# Altium project STM32H743.PrjPcb
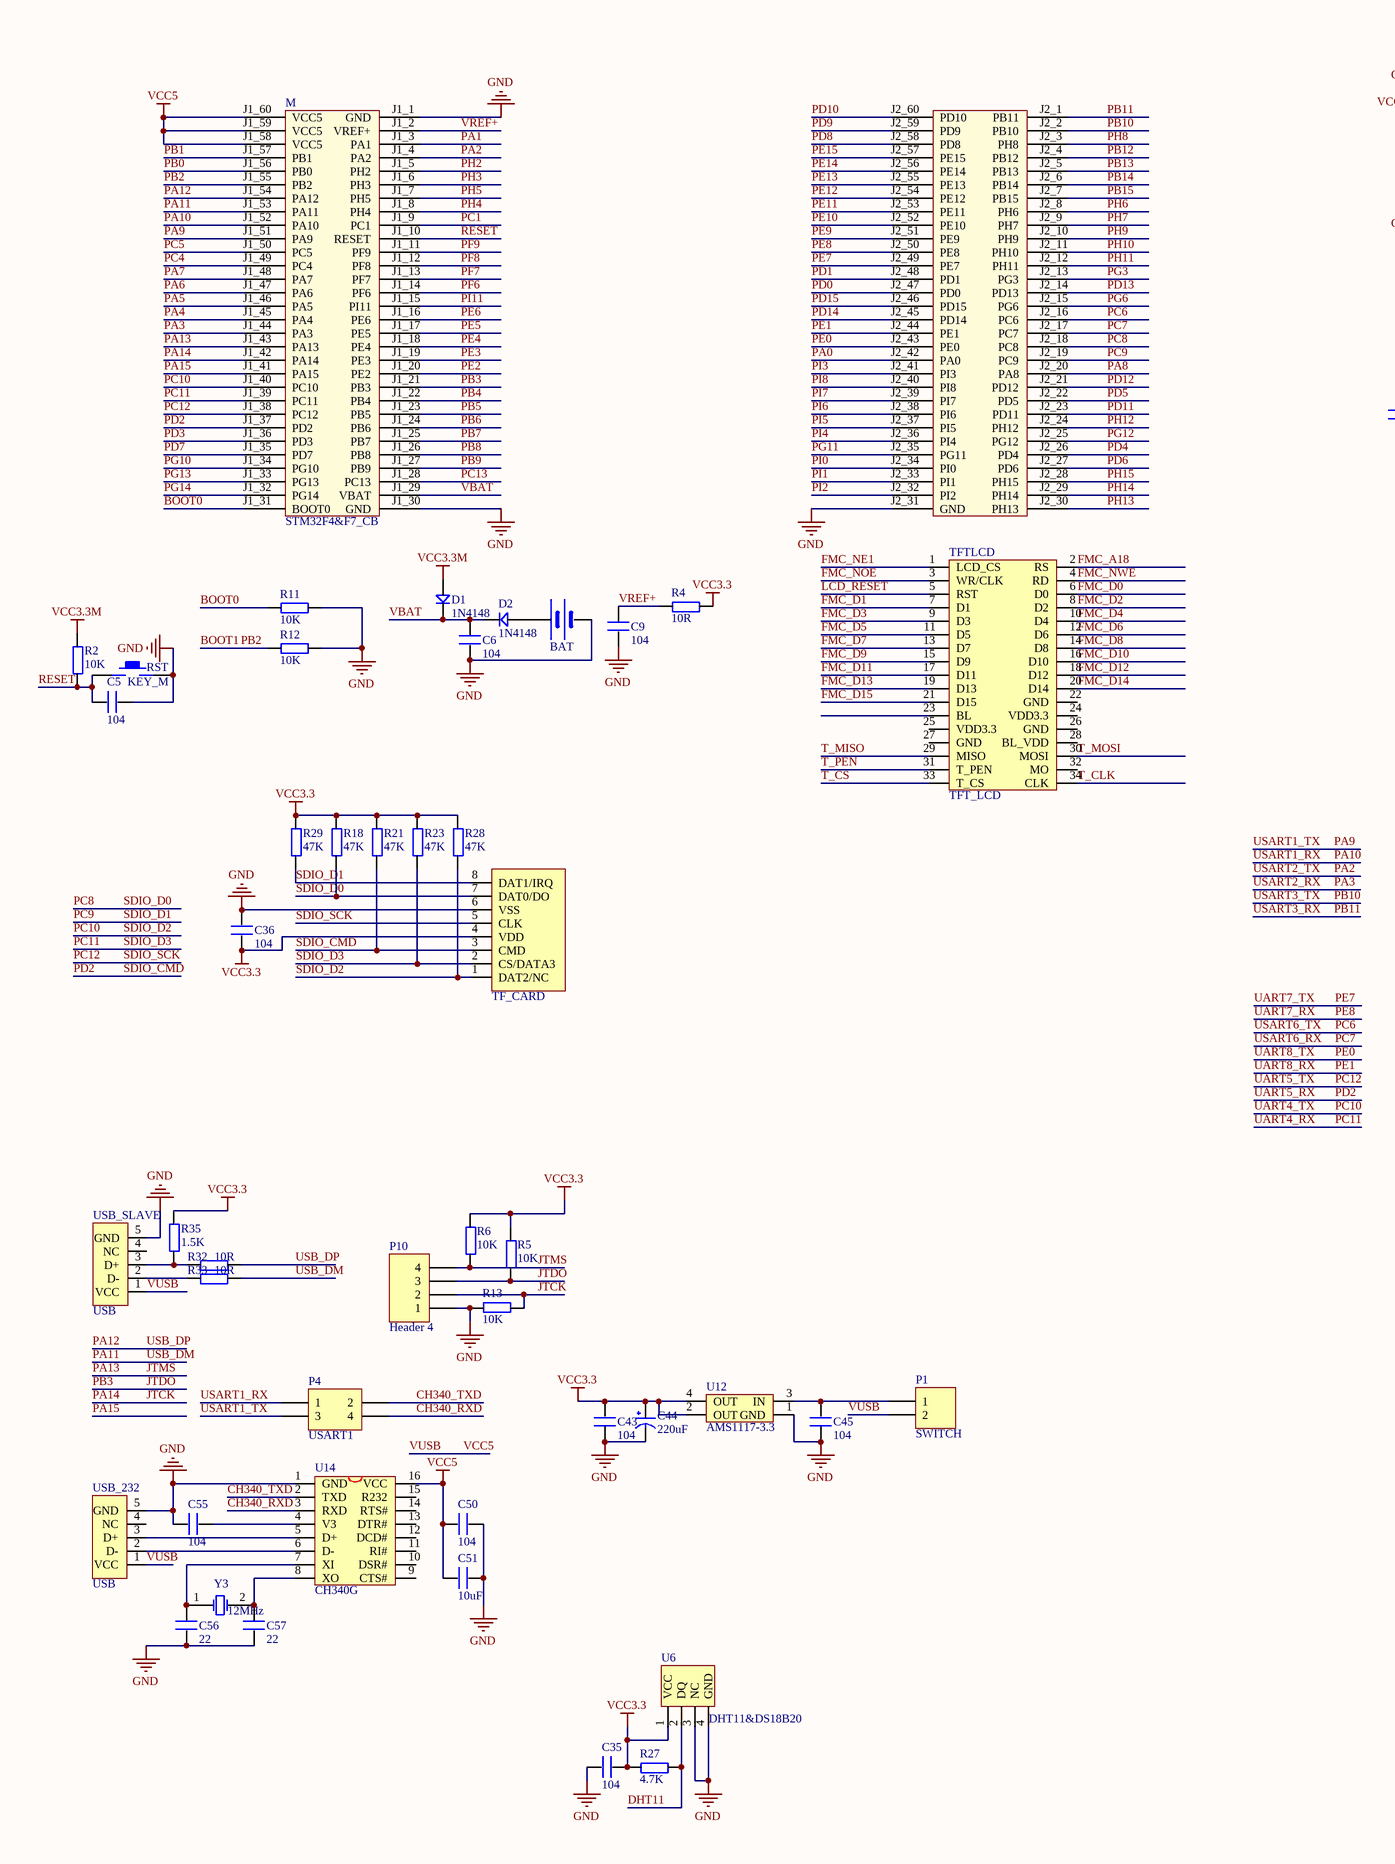
[diagram p0: STM32H743.SchDoc, left]
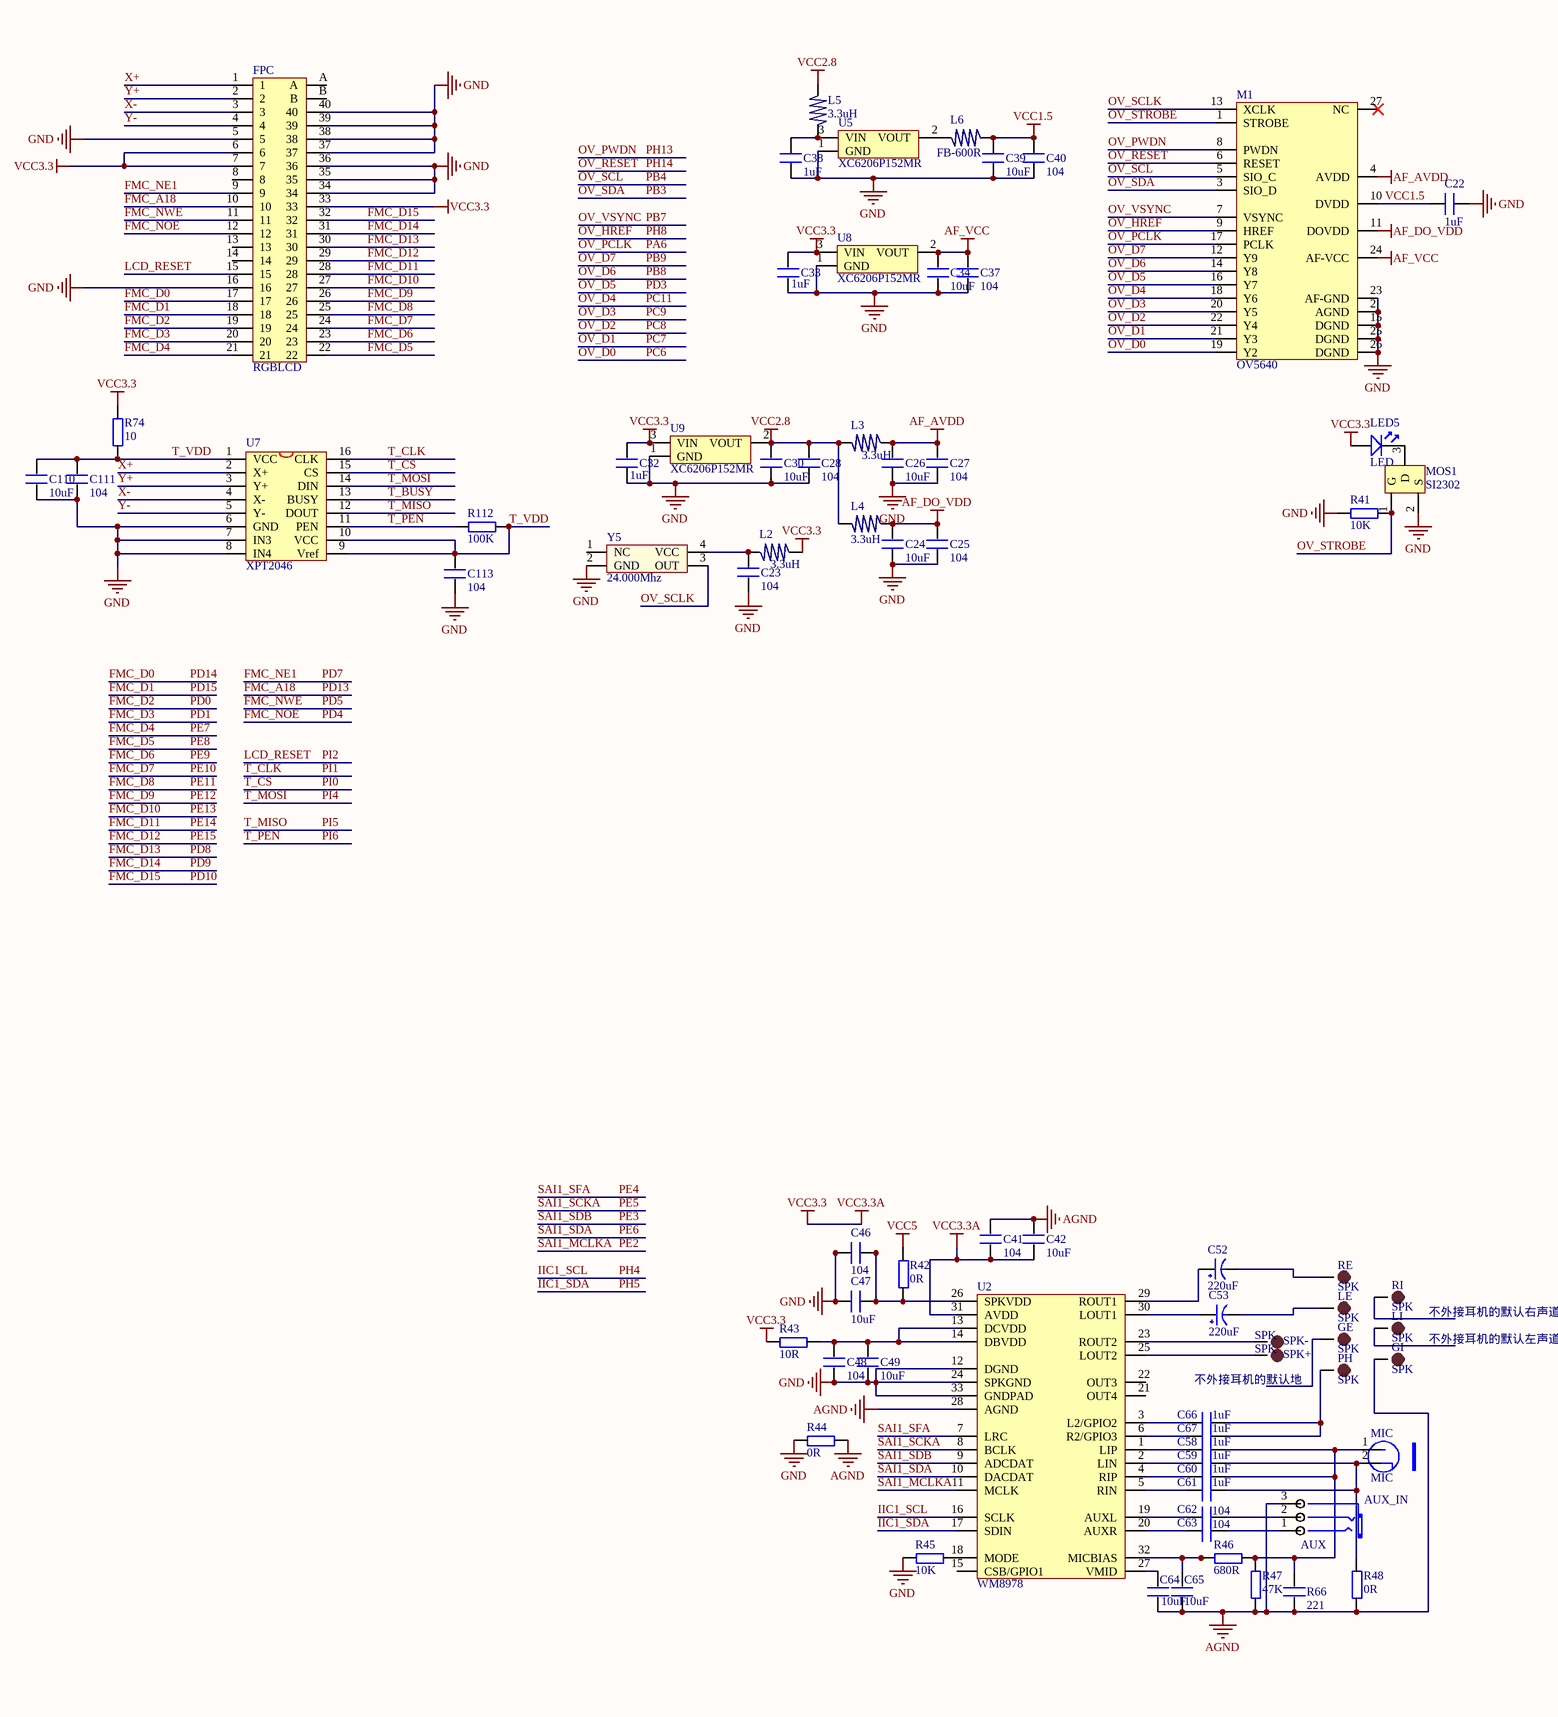
[diagram p1: STM32H743.SchDoc, right]
1 sheet, 118 parts. Net scope: global (net labels, ports and power ports of the same name join across sheets).
Board file: STM32H743.PcbDoc

## Sheet STM32H743.SchDoc
size A2

### Parts
AUX_IN  AUX  [PHONE_ST]
BAT  BATT  [CR1220_A]  (value not drawn)
C5  104  [C 0603_M]
C6  104  [C 0603_M]
C9  104  [C 0603_M]
C22  1uF  [C 0603_M]
C23  104  [C 0603_M]
C24  10uF  [C 0603_M]
C25  104  [C 0603_M]
C26  10uF  [C 0603_M]
C27  104  [C 0603_M]
C28  104  [C 0603_M]
C30  10uF  [C 0603_M]
C32  1uF  [C 0603_M]
C33  1uF  [C 0603_M]
C34  10uF  [C 0603_M]
C35  104  [C 0603_M]
C36  104  [C 0603_M]
C37  104  [C 0603_M]
C38  1uF  [C 0603_M]
C39  10uF  [C 0603_M]
C40  104  [C 0603_M]
C41  104  [C 0603_M]
C42  10uF  [C 0603_M]
C43  104  [C 0603_M]
C44  220uF  [CT 6*6 - C]
C45  104  [C 0603_M]
C46  104  [C 0603_M]
C47  10uF  [C 0603_M]
C48  104  [C 0603_M]
C49  10uF  [C 0603_M]
C50  104  [C 0603_M]
C51  10uF  [C 0603_M]
C52  220uF  [CT 6*6 - C]
C53  220uF  [CT 6*6 - C]
C55  104  [C 0603_M]
C56  22  [C 0603_M]
C57  22  [C 0603_M]
C58  1uF  [C 0603_M]
C59  1uF  [C 0603_M]
C60  1uF  [C 0603_M]
C61  1uF  [C 0603_M]
C62  104  [C 0603_M]
C63  104  [C 0603_M]
C64  10uF  [C 0603_M]
C65  10uF  [C 0603_M]
C66  1uF  [C 0603_M]
C67  1uF  [C 0603_M]
C110  10uF  [C 0603_M]
C111  104  [C 0603_M]
C113  104  [C 0603_M]
D1  1N4148  [DIODE_SOP]
D2  1N4148  [DIODE_SOP]
FPC  RGBLCD  [FPC-TOP40]
GE  SPK  [TP-1.5]
GI  SPK  [TP-1.5]
L2  3.3uH  [L 0603]
L3  3.3uH  [L 0603]
L4  3.3uH  [L 0603]
L5  3.3uH  [L 0603]
L6  FB-600R  [L 0603]
LE  SPK  [TP-1.5]
LED5  LED  [LED 0805R]
LI  SPK  [TP-1.5]
M  STM32F4&F7_CB  [STM32F4&F7_CB]
M1  OV5640  [OV5640-24]
MIC  MIC  [MIC-6022]
MOS1  SI2302  [SOT23-3M]
P1  SWITCH  [HDR2.54-LI-2P]
P4  USART1  [HDR2.54-LI-2x2P]
P10  Header 4  [HDR2.54-LI-4P]
PH  SPK  [TP-1.5]
R2  10K  [R 0603_M]
R4  10R  [R 0603_M]
R5  10K  [R 0603_M]
R6  10K  [R 0603_M]
R11  10K  [R 0603_M]
R12  10K  [R 0603_M]
R13  10K  [R 0603_M]
R18  47K  [R 0603_M]
R21  47K  [R 0603_M]
R23  47K  [R 0603_M]
R27  4.7K  [R 0603_M]
R28  47K  [R 0603_M]
R29  47K  [R 0603_M]
R32  10R  [R 0603_M]
R33  10R  [R 0603_M]
R35  1.5K  [R 0603_M]
R41  10K  [R 0603_M]
R42  0R  [R 0603_M]
R43  10R  [R 0603_M]
R44  0R  [R 0603_M]
R45  10K  [R 0603_M]
R46  680R  [R 0603_M]
R47  47K  [R 0603_M]
R48  0R  [R 0603_M]
R66  221  [C 0603_M]
R74  10  [R 0603_M]
R112  100K  [R 0603_M]
RE  SPK  [TP-1.5]
RI  SPK  [TP-1.5]
RST  KEY_M  [TSW SMD-3*6*2.5]
SPK+  SPK  [TP-1.5]
SPK-  SPK  [TP-1.5]
TF_CARD  SD-MICRO-TF  [SD-MICRO-TF]  (value not drawn)
TFTLCD  TFT_LCD  [DB2*17-3.5]
U2  WM8978  [qfn32]
U5  XC6206P152MR  [SOT23-3M]
U6  DHT11&DS18B20  [DHT11]
U7  XPT2046  [SSOP16_M]
U8  XC6206P152MR  [SOT23-3M]
U9  XC6206P152MR  [SOT23-3M]
U12  AMS1117-3.3  [AMS1117]
U14  CH340G  [SOP16_M]
USB_232  USB  [USB-MINI-A]
USB_SLAVE  USB  [USB-MINI-A]
Y3  12MHz  [OSC HC-49S]
Y5  24.000Mhz  [OSC 3225-4P]

### Nets
AF_AVDD: C26.2 C27.2 L3.1 M1.4(AVDD)
AF_DO_VDD: C24.2 C25.2 L4.1 M1.11(DOVDD)
AF_VCC: C34.2 C37.2 M1.24(AF-VCC) U8.2(VOUT)
AGND: AUX_IN.3(COM) C41.2 C42.2 C64.1 C65.1 GI.1 R44.2 R47.1 R48.1 R66.1 U2.28(AGND)
GND: BAT.2(GND) C5.1 C6.1 C9.1 C22.2 C23.1 C24.1 C25.1 C26.1 C27.1 C28.1 C30.1 C32.1 C33.1 C34.1 C35.1 C36.2 C37.1 C38.1 C39.1 C40.1 C43.1 C44.2(GND) C45.1 C46.1 C47.1 C48.1 C49.1 C50.2 C51.2 C55.1 C56.1 C57.2 C110.1 C111.1 C113.1 FPC.5 FPC.16 FPC.34 FPC.35 FPC.36 FPC.37 FPC.38 FPC.39 FPC.40 M.J1_1(GND) M.J1_30(GND) M.J2_31(GND) M1.2(AGND) M1.15(DGND) M1.23(AF-GND) M1.25(DGND) M1.26(DGND) MOS1.2(S) P10.1 R11.2 R12.2 R13.2 R41.1 R44.1 R45.1 RST.2 TF_CARD.6(VSS) U2.12(DGND) U2.24(SPKGND) U2.33(GNDPAD) U5.1(GND) U6.3(NC) U6.4(GND) U7.6(GND) U7.7(IN3) U7.8(IN4) U8.1(GND) U9.1(GND) U12.1(GND) U14.1(GND) USB_232.5(GND) USB_SLAVE.5(GND) Y5.2(GND)
VCC1.5: C22.1 C39.2 C40.2 L6.2 M1.10(DVDD)
VCC2.8: C28.2 C30.2 L3.2 L4.2 L5.1 U9.2(VOUT)
VCC3.3: C32.2 C33.2 C35.2 C36.1 C41.1 C42.1 C43.2 C44.1(VCC) FPC.6 FPC.7 FPC.33 L2.2 LED5.1 R4.2 R5.2 R6.2 R18.2 R21.2 R23.2 R27.1 R28.2 R29.2 R35.2 R43.1 R74.2 TF_CARD.4(VDD) U2.31(AVDD) U6.1(VCC) U8.3(VIN) U9.3(VIN) U12.2(OUT) U12.4(OUT)  [also labelled VCC3.3A]
VCC3.3M: D1.1 R2.2
VCC5: C50.1 C51.1 M.J1_58(VCC5) M.J1_59(VCC5) M.J1_60(VCC5) P1.2 R42.2 U14.16(VCC) USB_232.1(VCC) USB_SLAVE.1(VCC)  [also labelled VUSB]
BOOT0: M.J1_31(BOOT0) R11.1
BOOT1: M.J1_55(PB2) R12.1  [also labelled PB2]
CH340_RXD: P4.4 U14.3(RXD)
CH340_TXD: P4.2 U14.2(TXD)
DHT11: R27.2 U6.2(DQ)
FMC_A18: FPC.10 M.J2_14(PD13) TFTLCD.2(RS)  [also labelled PD13]
FMC_D0: FPC.17 M.J2_45(PD14) TFTLCD.6(D0)  [also labelled PD14]
FMC_D1: FPC.18 M.J2_46(PD15) TFTLCD.7(D1)  [also labelled PD15]
FMC_D2: FPC.19 M.J2_47(PD0) TFTLCD.8(D2)  [also labelled PD0]
FMC_D3: FPC.20 M.J2_48(PD1) TFTLCD.9(D3)  [also labelled PD1]
FMC_D4: FPC.21 M.J2_49(PE7) TFTLCD.10(D4)  [also labelled PE7, UART7_TX]
FMC_D5: FPC.22 M.J2_50(PE8) TFTLCD.11(D5)  [also labelled PE8, UART7_RX]
FMC_D6: FPC.23 M.J2_51(PE9) TFTLCD.12(D6)  [also labelled PE9]
FMC_D7: FPC.24 M.J2_52(PE10) TFTLCD.13(D7)  [also labelled PE10]
FMC_D8: FPC.25 M.J2_53(PE11) TFTLCD.14(D8)  [also labelled PE11]
FMC_D9: FPC.26 M.J2_54(PE12) TFTLCD.15(D9)  [also labelled PE12]
FMC_D10: FPC.27 M.J2_55(PE13) TFTLCD.16(D10)  [also labelled PE13]
FMC_D11: FPC.28 M.J2_56(PE14) TFTLCD.17(D11)  [also labelled PE14]
FMC_D12: FPC.29 M.J2_57(PE15) TFTLCD.18(D12)  [also labelled PE15]
FMC_D13: FPC.30 M.J2_58(PD8) TFTLCD.19(D13)  [also labelled PD8]
FMC_D14: FPC.31 M.J2_59(PD9) TFTLCD.20(D14)  [also labelled PD9]
FMC_D15: FPC.32 M.J2_60(PD10) TFTLCD.21(D15)  [also labelled PD10]
FMC_NE1: FPC.9 M.J1_35(PD7) TFTLCD.1(LCD_CS)  [also labelled PD7]
FMC_NOE: FPC.12 M.J2_26(PD4) TFTLCD.3(WR/CLK)  [also labelled PD4]
FMC_NWE: FPC.11 M.J2_22(PD5) TFTLCD.4(RD)  [also labelled PD5]
IIC1_SCL: M.J1_8(PH4) U2.16(SCLK)  [also labelled PH4]
IIC1_SDA: M.J1_7(PH5) U2.17(SDIN)  [also labelled PH5]
JTCK: M.J1_42(PA14) P10.2 R13.1  [also labelled PA14]
JTDO: M.J1_21(PB3) M1.3(SIO_D) P10.3 R5.1  [also labelled OV_SDA, PB3]
JTMS: M.J1_43(PA13) P10.4 R6.1  [also labelled PA13]
LCD_RESET: FPC.15 M.J2_32(PI2) TFTLCD.5(RST)  [also labelled PI2]
OV_D0: M.J2_16(PC6) M1.19(Y2)  [also labelled PC6, USART6_TX]
OV_D1: M.J2_17(PC7) M1.21(Y3)  [also labelled PC7, USART6_RX]
OV_D2: M.J2_18(PC8) M1.22(Y4) R18.1 TF_CARD.7(DAT0/DO)  [also labelled PC8, SDIO_D0]
OV_D3: M.J2_19(PC9) M1.20(Y5) R29.1 TF_CARD.8(DAT1/IRQ)  [also labelled PC9, SDIO_D1]
OV_D4: M.J1_39(PC11) M1.18(Y6) R23.1 TF_CARD.2(CS/DATA3)  [also labelled PC11, SDIO_D3, UART4_RX]
OV_D5: M.J1_36(PD3) M1.16(Y7)  [also labelled PD3]
OV_D6: M.J1_26(PB8) M1.14(Y8)  [also labelled PB8]
OV_D7: M.J1_27(PB9) M1.12(Y9)  [also labelled PB9]
OV_HREF: M.J2_3(PH8) M1.9(HREF)  [also labelled PH8]
OV_PCLK: M.J1_47(PA6) M1.17(PCLK)  [also labelled PA6]
OV_PWDN: M.J2_30(PH13) M1.8(PWDN)  [also labelled PH13]
OV_RESET: M.J2_29(PH14) M1.6(RESET)  [also labelled PH14]
OV_SCL: M.J1_22(PB4) M1.5(SIO_C)  [also labelled PB4]
OV_SCLK: M1.13(XCLK) Y5.3(OUT)
OV_STROBE: M1.1(STROBE) MOS1.1(G) R41.2
OV_VSYNC: M.J1_25(PB7) M1.7(VSYNC)  [also labelled PB7]
PA0: M.J2_42(PA0)
PA1: M.J1_3(PA1)
PA2: M.J1_4(PA2)  [also labelled USART2_TX]
PA3: M.J1_44(PA3)  [also labelled USART2_RX]
PA4: M.J1_45(PA4)
PA5: M.J1_46(PA5)
PA7: M.J1_48(PA7)
PA8: M.J2_20(PA8)
PA9: M.J1_51(PA9) P4.3  [also labelled USART1_TX]
PA10: M.J1_52(PA10) P4.1  [also labelled USART1_RX]
PA11: M.J1_53(PA11) R33.2  [also labelled USB_DM]
PA12: M.J1_54(PA12) R32.2  [also labelled USB_DP]
PA15: M.J1_41(PA15)
PB0: M.J1_56(PB0)
PB1: M.J1_57(PB1)
PB5: M.J1_23(PB5)
PB6: M.J1_24(PB6)
PB10: M.J2_2(PB10)  [also labelled USART3_TX]
PB11: M.J2_1(PB11)  [also labelled USART3_RX]
PB12: M.J2_4(PB12)
PB13: M.J2_5(PB13)
PB14: M.J2_6(PB14)
PB15: M.J2_7(PB15)
PC1: M.J1_9(PC1)
PC4: M.J1_49(PC4)
PC5: M.J1_50(PC5)
PC10: M.J1_40(PC10) R28.1 TF_CARD.1(DAT2/NC)  [also labelled SDIO_D2, UART4_TX]
PC12: M.J1_38(PC12) TF_CARD.5(CLK)  [also labelled SDIO_SCK, UART5_TX]
PC13: M.J1_28(PC13)
PD2: M.J1_37(PD2) R21.1 TF_CARD.3(CMD)  [also labelled SDIO_CMD, UART5_RX]
PD6: M.J2_27(PD6)
PD11: M.J2_23(PD11)
PD12: M.J2_21(PD12)
PE0: M.J2_43(PE0)  [also labelled UART8_TX]
PE1: M.J2_44(PE1)  [also labelled UART8_RX]
PE2: M.J1_20(PE2) U2.11(MCLK)  [also labelled SAI1_MCLKA]
PE3: M.J1_19(PE3) U2.9(ADCDAT)  [also labelled SAI1_SDB]
PE4: M.J1_18(PE4) U2.7(LRC)  [also labelled SAI1_SFA]
PE5: M.J1_17(PE5) U2.8(BCLK)  [also labelled SAI1_SCKA]
PE6: M.J1_16(PE6) U2.10(DACDAT)  [also labelled SAI1_SDA]
PF6: M.J1_14(PF6)
PF7: M.J1_13(PF7)
PF8: M.J1_12(PF8)
PF9: M.J1_11(PF9)
PG3: M.J2_13(PG3)
PG6: M.J2_15(PG6)
PG10: M.J1_34(PG10)
PG11: M.J2_35(PG11)
PG12: M.J2_25(PG12)
PG13: M.J1_33(PG13)
PG14: M.J1_32(PG14)
PH2: M.J1_5(PH2)
PH3: M.J1_6(PH3)
PH6: M.J2_8(PH6)
PH7: M.J2_9(PH7)
PH9: M.J2_10(PH9)
PH10: M.J2_11(PH10)
PH11: M.J2_12(PH11)
PH12: M.J2_24(PH12)
PH15: M.J2_28(PH15)
PI0: M.J2_34(PI0) TFTLCD.33(T_CS) U7.15(CS)  [also labelled T_CS]
PI1: M.J2_33(PI1) TFTLCD.34(CLK) U7.16(CLK)  [also labelled T_CLK]
PI3: M.J2_41(PI3)
PI4: M.J2_36(PI4) TFTLCD.30(MOSI) U7.14(DIN)  [also labelled T_MOSI]
PI5: M.J2_37(PI5) TFTLCD.29(MISO) U7.12(DOUT)  [also labelled T_MISO]
PI6: M.J2_38(PI6) R112.1 TFTLCD.31(T_PEN) U7.11(PEN)  [also labelled T_PEN]
PI7: M.J2_39(PI7)
PI8: M.J2_40(PI8)
PI11: M.J1_15(PI11)
RESET: C5.2 M.J1_10(RESET) R2.1 RST.1
T_BUSY: U7.13(BUSY)
T_VDD: C110.2 C111.2 C113.2 R74.1 R112.2 U7.1(VCC) U7.9(Vref) U7.10(VCC)
VBAT: C6.2 D1.2 D2.2 M.J1_29(VBAT)
VREF+: C9.2 M.J1_2(VREF+) R4.1
X+: FPC.1 U7.2(X+)
X-: FPC.3 U7.4(X-)
Y+: FPC.2 U7.3(Y+)
Y-: FPC.4 U7.5(Y-)
NetAUX_IN_1: AUX_IN.1(CHL) C63.2
NetAUX_IN_2: AUX_IN.2(CHR) C62.2
NetBAT_1: BAT.1(VCC) D2.1
NetC23_2: C23.2 L2.1 Y5.4(VCC)
NetC38_2: C38.2 L5.2 U5.3(VIN)
NetC45_2: C45.2 P1.1 U12.3(IN)
NetC46_2: C46.2 C47.2 R42.1 U2.26(SPKVDD)
NetC48_2: C48.2 C49.2 R43.2 U2.13(DCVDD) U2.14(DBVDD)
NetC52_1: C52.1(VCC) U2.29(ROUT1)
NetC52_2: C52.2(GND) RE.1
NetC53_1: C53.1(VCC) U2.30(LOUT1)
NetC53_2: C53.2(GND) LE.1
NetC55_2: C55.2 U14.4(V3)
NetC56_2: C56.2 U14.7(XI) Y3.1(OSC1)
NetC57_1: C57.1 U14.8(XO) Y3.2(OSC2)
NetC58_1: C58.1 U2.1(LIP)
NetC58_2: C58.2 C60.2 MIC.1(VCC) R46.2 R47.2 R66.2
NetC59_1: C59.1 U2.2(LIN)
NetC59_2: C59.2 C61.2 MIC.2(GND) R48.2
NetC60_1: C60.1 U2.4(RIP)
NetC61_1: C61.1 U2.5(RIN)
NetC62_1: C62.1 U2.19(AUXL)
NetC63_1: C63.1 U2.20(AUXR)
NetC64_2: C64.2 U2.27(VMID)
NetC65_2: C65.2 R46.1 U2.32(MICBIAS)
NetC66_1: C66.1 U2.3(L2/GPIO2)
NetC66_2: C66.2 C67.2 PH.1
NetC67_1: C67.1 U2.6(R2/GPIO3)
NetL6_1: L6.1 U5.2(VOUT)
NetLED5_2: LED5.2 MOS1.3(D)
NetR32_1: R32.1 R35.1 USB_SLAVE.3(D+)
NetR33_1: R33.1 USB_SLAVE.2(D-)
NetR45_2: R45.2 U2.18(MODE)
NetSPK+_1: SPK+.1 U2.25(LOUT2)
NetSPK-_1: SPK-.1 U2.23(ROUT2)
NetU14_5: U14.5(D+) USB_232.3(D+)
NetU14_6: U14.6(D-) USB_232.2(D-)

Not connected (* = marked no-connect by the designer): FPC 8 13 14 A B; GE 1; LI 1; M1 27(NC)*; RI 1; TFTLCD 22(GND) 23(BL) 24(VDD3.3) 25(VDD3.3) 26(GND) 27(GND) 28(BL_VDD) 32(MO); U2 15(CSB/GPIO1) 21(OUT4) 22(OUT3); U14 9(CTS#) 10(DSR#) 11(RI#) 12(DCD#) 13(DTR#) 14(RTS#) 15(R232); USB_232 4(NC); USB_SLAVE 4(NC); Y5 1(NC)

### Notes on the sheet
- 不外接耳机的默认右声道
- 不外接耳机的默认左声道
- 不外接耳机的默认地

### Library data of the parts
AUX_IN = PHONE_M
BAT = BAT
C5 C6 C9 C22-C28 C30 C32-C43 C45-C51 C55-C67 C110 C111 C113 R66 = C
C44 C52 C53 = CAP
D1 D2 = D
FPC = FPC-40: FPC-40P-0.5mm
GE GI LE LI PH RE RI SPK+ SPK- = TEST-POINT: 测试点
L2-L6 = L
M = STM32F4&F7_CB: F429/746 Core Board
M1 = OV5640: OV5640模组,AF,FPC
MOS1 = MOS-N: AP2306
P1 = Header 2: Header, 2-Pin; LatestRevisionDate: 17-Jul-2002; LatestRevisionNote: Re-released for DXP Platform.; Publisher: Altium Limited
P4 = Header 2X2: Header, 2-Pin, Dual row; LatestRevisionDate: 17-Jul-2002; LatestRevisionNote: Re-released for DXP Platform.; Publisher: Altium Limited
P10 = Header 4: Header, 4-Pin; LatestRevisionDate: 17-Jul-2002; LatestRevisionNote: Re-released for DXP Platform.; Publisher: Altium Limited
R2 R4-R6 R11-R13 R18 R21 R23 R27-R29 R32 R33 R35 R41-R48 R74 R112 = R
TF_CARD = SD-MICRO-TF: SD,MICRO,TF
U2 = WM8978: 24bit ADC&DAC
U5 U8 U9 = XC6206: LDO,SOT23,1.2~5.0V
U6 = DHT11: 数字温湿度传感器
U7 = ADS7843
U12 = AMS1117
U14 = CH340G: USB2UART
USB_232 USB_SLAVE = USB5
Y3 = XTAL: Crystal Oscillator; Published: 8-Jun-2000; LatestRevisionDate: 17-Jul-2002; LatestRevisionNote: Re-released for DXP Platform.; Publisher: Altium Limited
Y5 = XTAL_S: 有源晶振